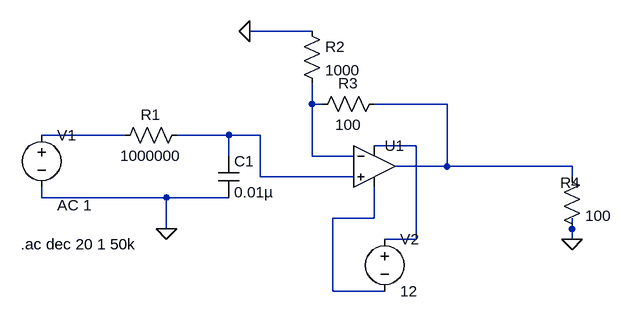
[diagram p0: schematic active_low_pass_filter.asc]
active_low_pass_filter.asc, the LTspice schematic file:
Version 4.1
SHEET 1 880 680
WIRE 320 -96 224 -96
WIRE 320 16 320 -16
WIRE 336 16 320 16
WIRE 528 16 416 16
WIRE 32 64 -96 64
WIRE 192 64 112 64
WIRE 240 64 192 64
WIRE 480 80 416 80
WIRE 192 96 192 64
WIRE 320 96 320 16
WIRE 384 96 320 96
WIRE 528 112 528 16
WIRE 528 112 448 112
WIRE 720 112 528 112
WIRE 240 128 240 64
WIRE 384 128 240 128
WIRE 720 128 720 112
WIRE -96 160 -96 144
WIRE 96 160 -96 160
WIRE 192 160 96 160
WIRE 416 192 416 144
WIRE 416 192 352 192
WIRE 96 208 96 160
WIRE 720 208 720 192
WIRE 480 224 480 80
WIRE 480 224 432 224
WIRE 720 224 720 208
WIRE 352 304 352 192
WIRE 432 304 352 304
FLAG 96 208 0
FLAG 224 -96 0
FLAG 720 224 0
SYMBOL cap 176 96 R0
WINDOW 3 24 56 Left 2
SYMATTR InstName C1
SYMATTR Value 0.01µ
SYMATTR Description Capacitor
SYMATTR Type cap
SYMATTR SpiceLine V=16 Irms=0 Rser=11 Lser=0 mfg="AVX" pn="TAJA105K016" type="Tantalum"
SYMBOL res 128 48 R90
WINDOW 0 0 56 VBottom 2
WINDOW 3 32 56 VTop 2
SYMATTR InstName R1
SYMATTR Value 1000000
SYMBOL voltage -96 48 R0
WINDOW 123 24 124 Left 2
WINDOW 39 0 0 Left 0
SYMATTR InstName V1
SYMATTR Value ""
SYMATTR Value2 AC 1
SYMBOL OpAmps\\UniversalOpAmp 416 112 R0
SYMATTR InstName U1
SYMBOL res 304 -112 R0
SYMATTR InstName R2
SYMATTR Value 1000
SYMBOL res 432 0 R90
WINDOW 0 0 56 VBottom 2
WINDOW 3 32 56 VTop 2
SYMATTR InstName R3
SYMATTR Value 100
SYMBOL voltage 432 208 R0
WINDOW 123 0 0 Left 0
WINDOW 39 0 0 Left 0
SYMATTR InstName V2
SYMATTR Value 12
SYMBOL res 704 112 R0
WINDOW 0 -2 25 Left 2
SYMATTR InstName R4
SYMATTR Value 100
TEXT -128 232 Left 2 !.ac dec 20 1 50k

The netlist it stands for:
* active_low_pass_filter.asc
C1 N004 0 0.01µ V=16 Irms=0 Rser=11 Lser=0 mfg="AVX" pn="TAJA105K016" type="Tantalum"
R1 N004 N003 1000000
V1 N003 0 AC 1
X§U1 N004 N001 N005 N006 N002 level1 Avol=1Meg GBW=10Meg Vos=0 En=0 Enk=0 In=0 Ink=0 Rin=500Meg  ; pins In+ In- V+ V- OUT
R2 0 N001 1000
R3 N002 N001 100
V2 N005 N006 12
R4 N002 0 100
.ac dec 20 1 50k
.lib UniversalOpAmp1.lib
.backanno
.end